# Altium project Car.PrjPcb
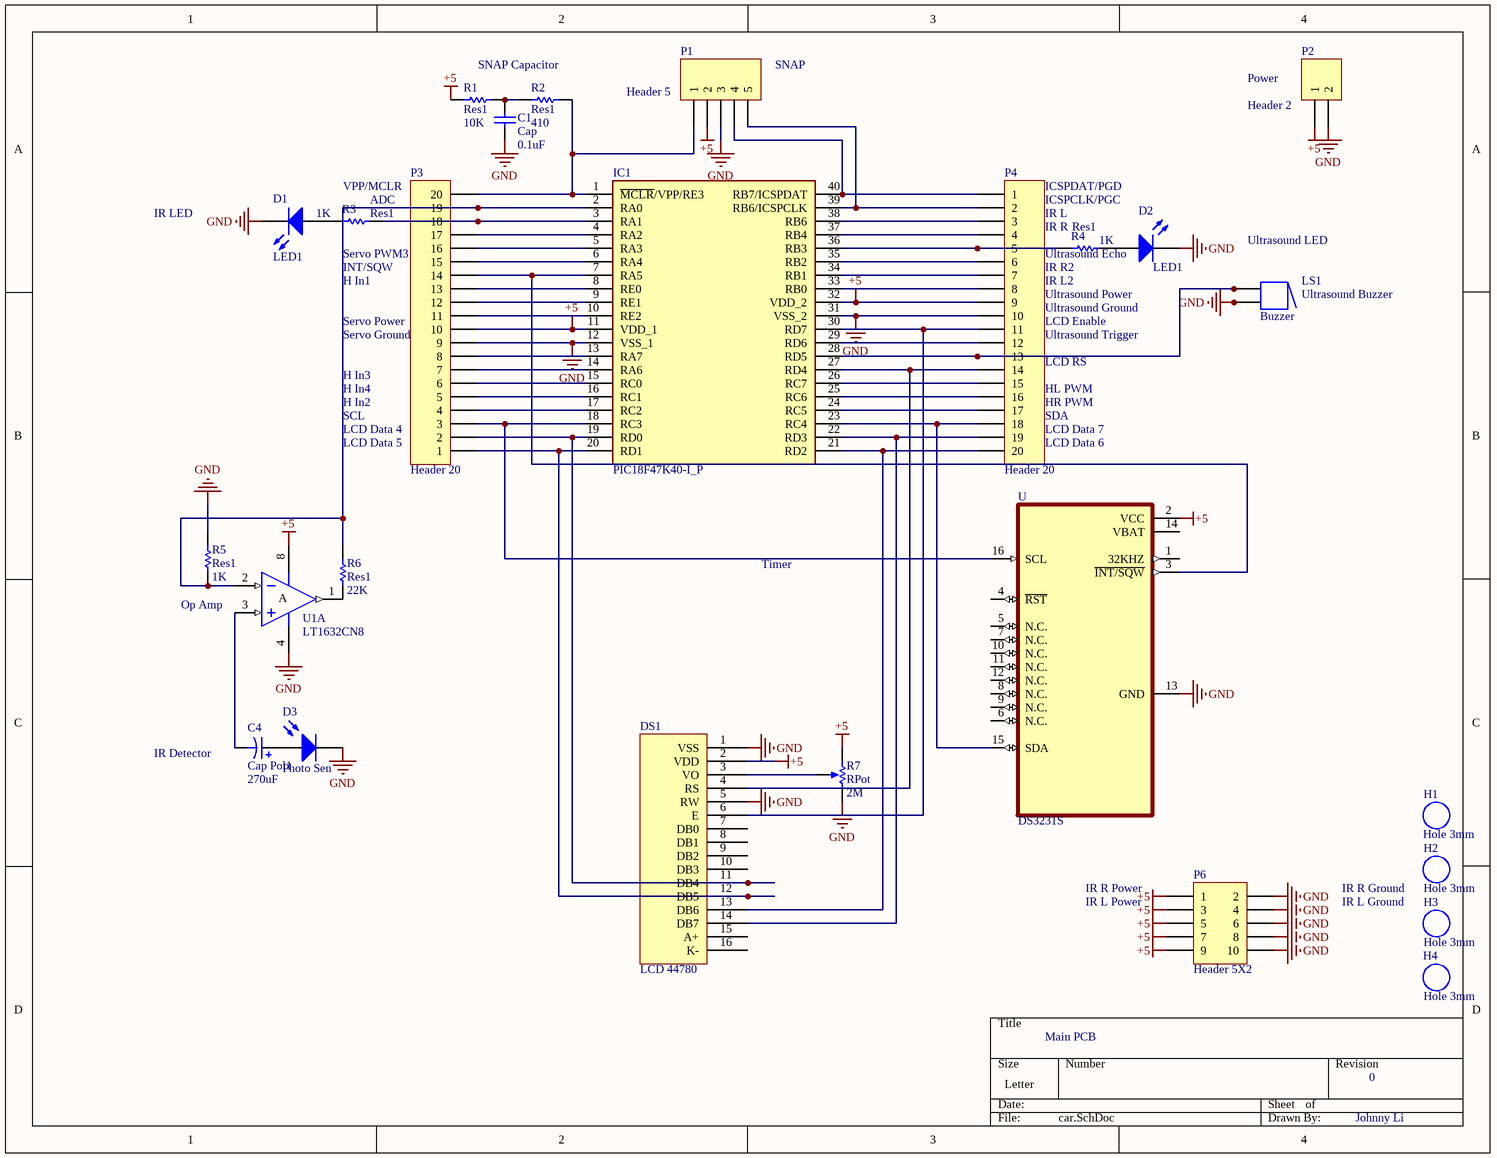
[diagram p0: car.SchDoc]
1 sheet, 26 parts. Net scope: global (net labels, ports and power ports of the same name join across sheets).
Board file: car_pcb.PcbDoc

## Sheet car.SchDoc
size Letter

### Parts
C1  Cap  value 0.1uF  [RAD-0.3]
C4  Cap Pol1  value 270uF  [RAD-0.2]
D1  LED1  [LED-1]
D2  LED1  [LED-1]
D3  Photo Sen  [PIN2]
DS1  LCD 44780  [OLED 16x2]
H1  Hole 3mm  [Hole 3mm]
H2  Hole 3mm  [Hole 3mm]
H3  Hole 3mm  [Hole 3mm]
H4  Hole 3mm  [Hole 3mm]
IC1  PIC18F47K40-I_P  [DIP1543W58P254L5175H635Q40N]
LS1  Buzzer  [ABSM-1574]
P1  Header 5  [HDR1X5]
P2  Header 2  [HDR1X2]
P3  Header 20  [HDR1X20]
P4  Header 20  [HDR1X20]
P6  Header 5X2  [HDR2X5]
R1  Res1  value 10K  [AXIAL-0.3]
R2  Res1  value 410  [AXIAL-0.3]
R3  Res1  value 1K  [AXIAL-0.3]
R4  Res1  value 1K  [AXIAL-0.3]
R5  Res1  value 1K  [AXIAL-0.3]
R6  Res1  value 22K  [AXIAL-0.3]
R7  RPot  value 2M  [VR5]
U  DS3231S  [SOIC127P1032X265-16N]
U1  LT1632CN8  [DIP-8]  (part A of 2)

### Nets
+5: DS1.2(VDD) IC1.11(VDD_1) IC1.32(VDD_2) P1.2 P2.1 P3.10 P4.9 P6.1 P6.3 P6.5 P6.7 P6.9 R1.1 R7.1(TOP) U.2(VCC) U1.8(V+)
GND: C1.1 D1.2(K) D2.2(K) D3.2(K) DS1.1(VSS) DS1.5(RW) IC1.12(VSS_1) IC1.31(VSS_2) LS1.2 LS1.2A P1.3 P2.2 P3.9 P4.10 P6.2 P6.4 P6.6 P6.8 P6.10 R5.2 R7.2(BOT) U.13(GND) U1.4(V-)
NetC1_2: C1.2 R1.2 R2.1
NetC4_1: C4.1 D3.1(A)
NetC4_2: C4.2 U1.3(IN+)
NetD1_1: D1.1(A) R3.2
NetD2_1: D2.1(A) R4.2
NetDS1_3: DS1.3(VO) R7.3(TAP)
NetDS1_4: DS1.4(RS) IC1.27(RD4) P4.14
NetDS1_6: DS1.6(E) IC1.30(RD7) P4.11
NetDS1_11: DS1.11(DB4) IC1.19(RD0) P3.2
NetDS1_12: DS1.12(DB5) IC1.20(RD1) P3.1
NetDS1_13: DS1.13(DB6) IC1.21(RD2) P4.20
NetDS1_14: DS1.14(DB7) IC1.22(RD3) P4.19
NetIC1_1: IC1.1(~{MCLR}/VPP/RE3) P1.1 P3.20 R2.2
NetIC1_2: IC1.2(RA0) P3.19 R5.1 R6.2 U1.2(IN-)
NetIC1_3: IC1.3(RA1) P3.18 R3.1
NetIC1_4: IC1.4(RA2) P3.17
NetIC1_5: IC1.5(RA3) P3.16
NetIC1_6: IC1.6(RA4) P3.15
NetIC1_7: IC1.7(RA5) P3.14 U.3(~{INT/SQW})
NetIC1_8: IC1.8(RE0) P3.13
NetIC1_9: IC1.9(RE1) P3.12
NetIC1_10: IC1.10(RE2) P3.11
NetIC1_13: IC1.13(RA7) P3.8
NetIC1_14: IC1.14(RA6) P3.7
NetIC1_15: IC1.15(RC0) P3.6
NetIC1_16: IC1.16(RC1) P3.5
NetIC1_17: IC1.17(RC2) P3.4
NetIC1_18: IC1.18(RC3) P3.3 U.16(SCL)
NetIC1_23: IC1.23(RC4) P4.18 U.15(SDA)
NetIC1_24: IC1.24(RC5) P4.17
NetIC1_25: IC1.25(RC6) P4.16
NetIC1_26: IC1.26(RC7) P4.15
NetIC1_28: IC1.28(RD5) LS1.1 LS1.1A P4.13
NetIC1_29: IC1.29(RD6) P4.12
NetIC1_33: IC1.33(RB0) P4.8
NetIC1_34: IC1.34(RB1) P4.7
NetIC1_35: IC1.35(RB2) P4.6
NetIC1_36: IC1.36(RB3) P4.5 R4.1
NetIC1_37: IC1.37(RB4) P4.4
NetIC1_38: IC1.38(RB6) P4.3
NetIC1_39: IC1.39(RB6/ICSPCLK) P1.5 P4.2
NetIC1_40: IC1.40(RB7/ICSPDAT) P1.4 P4.1
NetR6_1: R6.1 U1.1(OUT)

Not connected (* = marked no-connect by the designer): DS1 7(DB0) 8(DB1) 9(DB2) 10(DB3) 15(A+) 16(K-); U 1(32KHZ) 4(~{RST}) 5(N.C.) 6(N.C.) 7(N.C.) 8(N.C.) 9(N.C.) 10(N.C.) 11(N.C.) 12(N.C.) 14(VBAT)

### Notes on the sheet
- SNAP Capacitor
- (near P1) SNAP
- (near P2) Power
- IR LED
- (near R3) VPP/MCLR
- (near R3) ADC
- ICSPDAT/PGD
- ICSPCLK/PGC
- (near R4) IR R
- IR L
- H In1
- (near R3) Servo PWM3
- INT/SQW
- Ultrasound Echo
- Ultrasound Power
- IR L2
- (near R4) IR R2
- (near LS1) Ultrasound LED
- (near LS1) Ultrasound Buzzer
- (near P3) Servo Ground
- (near P3) Servo Power
- (near P4) Ultrasound Trigger
- Ultrasound Ground
- (near P4) LCD Enable
- (near P4) LCD RS
- (near P3) LCD Data 4
- H In3
- H In4
- H In2
- SCL
- (near P4) HL PWM
- (near P4) LCD Data 7
- (near P4) SDA
- (near P4) HR PWM
- (near P3) LCD Data 5
- (near P4) LCD Data 6
- Timer
- Op Amp
- (near C4) IR Detector
- (near P6) IR R Power
- (near P6) IR L Power
- IR R Ground
- IR L Ground
- Main PCB
- 0
- Johnny Li
- (in symbol LT1632CN8, part A) A

### Library data of the parts
C1 = Cap: Capacitor; Published: 8-Jun-2000; LatestRevisionDate: 17-Jul-2002; LatestRevisionNote: Re-released for DXP Platform.; PackageReference: RAD-0.3; Publisher: Altium Limited; PackageDescription: Radial Cap, Thru-Hole; 2 Leads; 0.3 in Pin Spacing
C4 = Cap Pol1: Polarized Capacitor (Radial); Published: 8-Jun-2000; LatestRevisionDate: 17-Jul-2002; LatestRevisionNote: Re-released for DXP Platform.; PackageReference: RB7.6-15; Publisher: Altium Limited; PackageDescription: Polarized Capacitor (Radial); 2 Leads
D1 D2 = LED1: Typical RED GaAs LED; Published: 8-Jun-2000; LatestRevisionDate: 08-Jul-2005; LatestRevisionNote: Mech Layer 1 removed.; PackageReference: LED-1; Publisher: Altium Limited; PackageDescription: LED; 2 Leads
D3 = Photo Sen: Photosensitive Diode; Published: 24-Mar-1999; LatestRevisionDate: 17-Jul-2002; LatestRevisionNote: Re-released for DXP Platform.; PackageReference: PIN2; Publisher: Altium Limited
IC1 = PIC18F47K40-I_P: Integrated Circuit; Manufacturer_Name: Microchip; Manufacturer_Part_Number: PIC18F47K40-I/P; Datasheet Link: https://componentsearchengine.com/Datasheets/2/PIC18F47K40-I_P.pdf; Height: 6.35mm; Mouser Part Number: 579-PIC18F47K40-I/P; Mouser Price/Stock: https://www.mouser.com/Search/Refine.aspx?Keyword=579-PIC18F47K40-I%2FP; RS Part Number: 1262152P; RS Price/Stock: http://uk.rs-online.com/web/p/products/1262152P
LS1 = Buzzer: Magnetic Transducer Buzzer; Published: 24-Mar-1999; LatestRevisionDate: 17-Dec-2003; LatestRevisionNote: Schematic revised, PCB Footprint replaced.; DatasheetVersion: 17-Dec-2003; PackageReference: ABSM-1574; Publisher: Altium Limited; PackageDescription: Magnetic Transducer Buzzer; ComponentLink1Description: Manufacturer Link; ComponentLink1URL: http://www.megastar.com/linecard/buzzmode/index.php
P1 = Header 5: Header, 5-Pin; LatestRevisionDate: 17-Jul-2002; LatestRevisionNote: Re-released for DXP Platform.; Publisher: Altium Limited
P2 = Header 2: Header, 2-Pin; LatestRevisionDate: 17-Jul-2002; LatestRevisionNote: Re-released for DXP Platform.; Publisher: Altium Limited
P3 P4 = Header 20: Header, 20-Pin; LatestRevisionDate: 17-Jul-2002; LatestRevisionNote: Re-released for DXP Platform.; Publisher: Altium Limited
P6 = Header 5X2: Header, 5-Pin, Dual row; LatestRevisionDate: 17-Jul-2002; LatestRevisionNote: Re-released for DXP Platform.; Publisher: Altium Limited
R1-R6 = Res1: Resistor; Published: 8-Jun-2000; LatestRevisionDate: 17-Jul-2002; LatestRevisionNote: Re-released for DXP Platform.; PackageReference: AXIAL-0.3; Publisher: Altium Limited; PackageDescription: Axial Device, Thru-Hole; 2 Leads; 0.3 in Pin Spacing
R7 = RPot: Potentiometer; Sim Note: Enter the Resistance value and the set point into parameter fields.; Set Position: 0.5; Published: 8-Jun-2000; LatestRevisionDate: 17-Jul-2002; LatestRevisionNote: Re-released for DXP Platform.; PackageReference: VR5; Publisher: Altium Limited; PackageDescription: Variable Resistor, Thru-Hole; 3 Leads
U = DS3231S: Real Time Clock _RTC_ IC Clock/Calendar IÂ²C, 2-Wire Serial 16-SOIC _0.295, 7.50mm Width_; MF: Maxim Integrated; Package: SOIC-16 Maxim Integrated; Value: *; Price: None; MP: DS3231S; Availability: Unavailable; SnapEDA_Link: https://www.snapeda.com/parts/DS3231S/Maxim%20Integrated/view-part/1065652/?ref=snap
U1 = LT1632CN8: 45MHz, 45V/µs, Dual Rail-to-Rail Input and Output Precision Operational Amplifier; Note: 1455; Published: 8-Jun-2000; LatestRevisionDate: 29-May-2009; LatestRevisionNote: Component Body Added.; DatasheetVersion: 1996; PackageVersion: N8 1002; PackageReference: N8; Publisher: Altium Limited; PackageDescription: DIP, Plastic, 8-Pin, Row Spacing 7.62 mm, Pitch 2.54 mm; ComponentLink1Description: Manufacturer Link; ComponentLink1URL: http://www.linear.com/; ComponentLink2Description: Datasheet; ComponentLink2URL: http://www.linear.com/pc/downloadDocument.do?navId=H0,C1,C1154,C1009,C1022,P1642,D3055